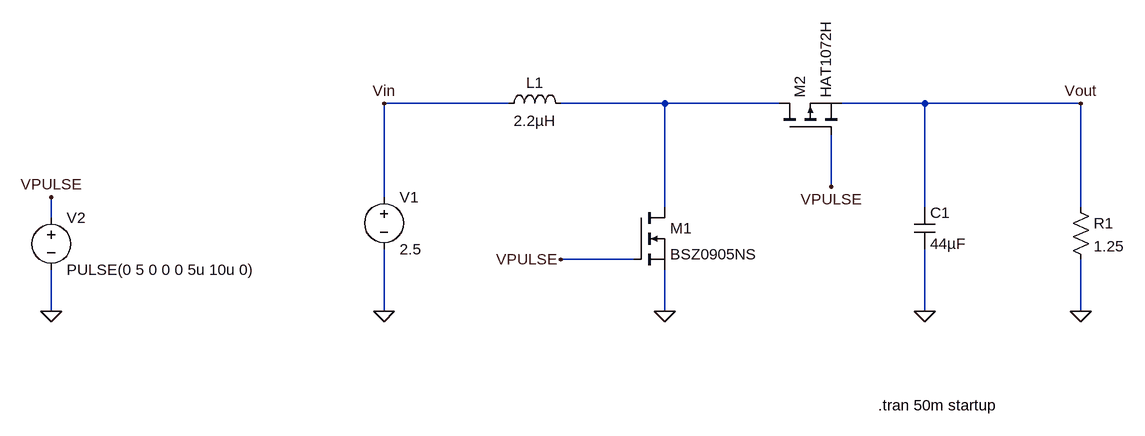
[diagram p0: schematic boost_converter.asc]
boost_converter.asc, the LTspice schematic file:
Version 4
SHEET 1 1244 680
WIRE 240 0 48 0
WIRE 480 0 320 0
WIRE 656 0 480 0
WIRE 880 0 752 0
WIRE 1120 0 880 0
WIRE 736 128 736 48
WIRE 48 144 48 0
WIRE 480 160 480 0
WIRE 880 160 880 0
WIRE 1120 160 1120 0
WIRE -464 176 -464 144
WIRE 432 240 320 240
WIRE -464 320 -464 256
WIRE 48 320 48 224
WIRE 480 320 480 256
WIRE 880 320 880 224
WIRE 1120 320 1120 240
FLAG 48 320 0
FLAG 480 320 0
FLAG 880 320 0
FLAG 1120 320 0
FLAG 48 0 Vin
FLAG 1120 0 Vout
FLAG -464 320 0
FLAG -464 144 VPULSE
FLAG 320 240 VPULSE
FLAG 736 128 VPULSE
SYMBOL voltage 48 128 R0
SYMATTR InstName V1
SYMATTR Value 2.5
SYMBOL ind 224 16 R270
WINDOW 0 32 56 VTop 2
WINDOW 3 5 56 VBottom 2
SYMATTR InstName L1
SYMATTR Value 2.2µH
SYMBOL res 1104 144 R0
SYMATTR InstName R1
SYMATTR Value 1.25
SYMBOL nmos 432 160 R0
SYMATTR InstName M1
SYMATTR Value BSZ0905NS
SYMBOL cap 864 160 R0
SYMATTR InstName C1
SYMATTR Value 44µF
SYMBOL voltage -464 160 R0
WINDOW 123 0 0 Left 0
WINDOW 39 0 0 Left 0
SYMATTR InstName V2
SYMATTR Value PULSE(0 5 0 0 0 5u 10u 0)
SYMBOL pmos 656 48 R270
SYMATTR InstName M2
SYMATTR Value HAT1072H
TEXT 808 464 Left 2 !.tran 50m startup

The netlist it stands for:
* boost_converter.asc
V1 Vin 0 2.5
L1 Vin N001 2.2µH
R1 Vout 0 1.25
M1 N001 VPULSE 0 0 BSZ0905NS
C1 Vout 0 44µF
V2 VPULSE 0 PULSE(0 5 0 0 0 5u 10u 0)
M2 N001 VPULSE Vout Vout HAT1072H
.model NMOS NMOS
.model PMOS PMOS
.lib standard.mos
.tran 50m startup
.backanno
.end